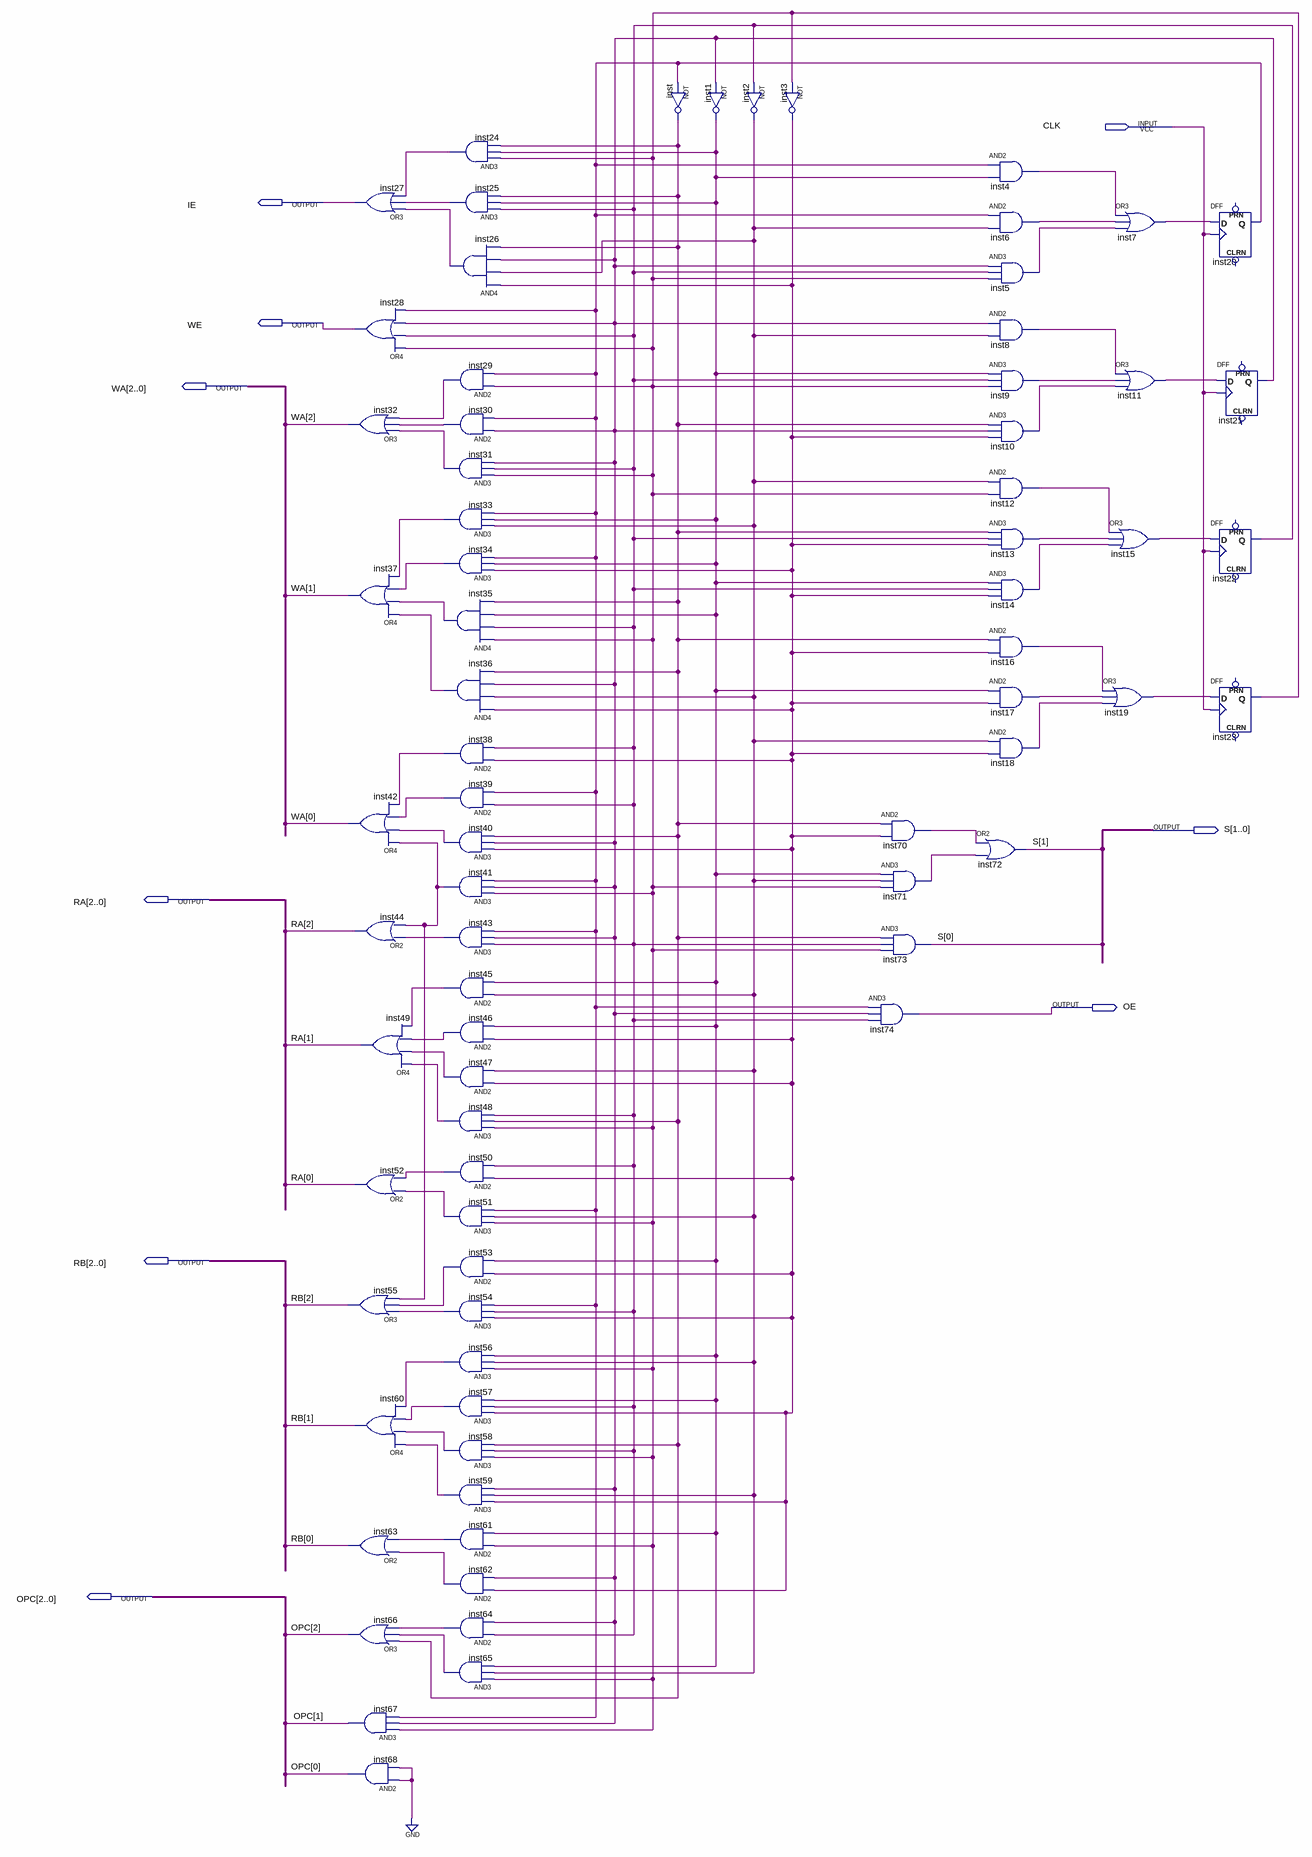
[diagram p0: schematic sheet]
// Quartus schematic Control_word.bdf as structural Verilog: 74 symbols, 9 pins
module Control_word (
  input  CLK,
  output IE,
  output WE,
  output [2:0] WA,
  output [1:0] S,
  output [2:0] RA,
  output OE,
  output [2:0] RB,
  output [2:0] OPC
);

  wire inst1_out, inst2_out, inst3_out, inst4_out, inst5_out, inst6_out, inst7_out, inst8_out, inst9_out,
       inst10_out, inst11_out, inst12_out, inst13_out, inst14_out, inst15_out, inst16_out, inst17_out,
       inst18_out, inst19_out, inst20_q, inst21_q, inst22_q, inst23_q, inst24_out, inst25_out, inst26_out,
       inst29_out, inst30_out, inst31_out, inst33_out, inst34_out, inst35_out, inst36_out, inst38_out,
       inst39_out, inst40_out, inst41_out, inst43_out, inst45_out, inst46_out, inst47_out, inst48_out,
       inst50_out, inst51_out, inst53_out, inst54_out, inst56_out, inst57_out, inst58_out, inst59_out,
       inst61_out, inst62_out, inst64_out, inst65_out, inst70_out, inst71_out, inst_out;

  or inst27 (IE, inst26_out, inst25_out, inst24_out);
  or inst28 (WE, inst23_q, inst22_q, inst21_q, inst20_q);
  or inst32 (WA[2], inst31_out, inst30_out, inst29_out);
  or inst37 (WA[1], inst36_out, inst35_out, inst34_out, inst33_out);
  or inst42 (WA[0], inst41_out, inst40_out, inst39_out, inst38_out);
  or inst44 (RA[2], inst43_out, inst41_out);
  or inst52 (RA[0], inst51_out, inst50_out);
  or inst55 (RB[2], inst54_out, inst53_out, inst41_out);
  or inst60 (RB[1], inst59_out, inst58_out, inst57_out, inst56_out);
  or inst63 (RB[0], inst62_out, inst61_out);
  or inst66 (OPC[2], inst_out, inst65_out, inst64_out);
  and inst67 (OPC[1], inst23_q, inst21_q, inst20_q);
  and inst68 (OPC[0], 1'b0, 1'b0);
  or inst49 (RA[1], inst48_out, inst47_out, inst46_out, inst45_out);
  and inst24 (inst24_out, inst23_q, inst1_out, inst_out);
  and inst25 (inst25_out, inst22_q, inst1_out, inst_out);
  and inst26 (inst26_out, inst3_out, inst2_out, inst21_q, inst_out);
  and inst29 (inst29_out, inst23_q, inst20_q);
  and inst30 (inst30_out, inst21_q, inst20_q);
  and inst31 (inst31_out, inst23_q, inst22_q, inst21_q);
  and inst33 (inst33_out, inst2_out, inst1_out, inst20_q);
  and inst34 (inst34_out, inst3_out, inst1_out, inst20_q);
  and inst35 (inst35_out, inst23_q, inst22_q, inst1_out, inst_out);
  and inst36 (inst36_out, inst3_out, inst2_out, inst21_q, inst_out);
  and inst38 (inst38_out, inst3_out, inst22_q);
  and inst39 (inst39_out, inst22_q, inst20_q);
  and inst40 (inst40_out, inst3_out, inst21_q, inst_out);
  and inst41 (inst41_out, inst23_q, inst21_q, inst20_q);
  and inst43 (inst43_out, inst22_q, inst21_q, inst20_q);
  and inst45 (inst45_out, inst2_out, inst1_out);
  and inst46 (inst46_out, inst3_out, inst1_out);
  and inst47 (inst47_out, inst3_out, inst2_out);
  and inst48 (inst48_out, inst23_q, inst_out, inst22_q);
  and inst50 (inst50_out, inst3_out, inst22_q);
  and inst51 (inst51_out, inst23_q, inst2_out, inst20_q);
  and inst53 (inst53_out, inst3_out, inst1_out);
  and inst54 (inst54_out, inst3_out, inst22_q, inst20_q);
  and inst56 (inst56_out, inst23_q, inst2_out, inst1_out);
  and inst57 (inst57_out, inst3_out, inst22_q, inst1_out);
  and inst58 (inst58_out, inst23_q, inst22_q, inst_out);
  and inst59 (inst59_out, inst3_out, inst2_out, inst21_q);
  and inst61 (inst61_out, inst23_q, inst1_out);
  and inst62 (inst62_out, inst3_out, inst21_q);
  and inst64 (inst64_out, inst22_q, inst21_q);
  and inst65 (inst65_out, inst23_q, inst2_out, inst1_out);
  not inst (inst_out, inst20_q);
  not inst1 (inst1_out, inst21_q);
  not inst2 (inst2_out, inst22_q);
  not inst3 (inst3_out, inst23_q);
  and inst70 (inst70_out, inst_out, inst3_out);
  and inst71 (inst71_out, inst1_out, inst2_out, inst23_q);
  and inst73 (S[0], inst_out, inst22_q, inst23_q);
  and inst74 (OE, inst20_q, inst21_q, inst22_q);
  and inst4 (inst4_out, inst20_q, inst1_out);
  and inst6 (inst6_out, inst20_q, inst2_out);
  and inst5 (inst5_out, inst21_q, inst22_q, inst23_q);
  and inst8 (inst8_out, inst21_q, inst2_out);
  and inst9 (inst9_out, inst1_out, inst22_q, inst23_q);
  and inst10 (inst10_out, inst_out, inst21_q, inst3_out);
  and inst12 (inst12_out, inst2_out, inst23_q);
  and inst13 (inst13_out, inst_out, inst22_q, inst3_out);
  and inst14 (inst14_out, inst1_out, inst22_q, inst3_out);
  and inst16 (inst16_out, inst_out, inst3_out);
  and inst17 (inst17_out, inst1_out, inst3_out);
  and inst18 (inst18_out, inst2_out, inst3_out);
  or inst72 (S[1], inst70_out, inst71_out);
  or inst7 (inst7_out, inst4_out, inst6_out, inst5_out);
  or inst11 (inst11_out, inst8_out, inst9_out, inst10_out);
  or inst15 (inst15_out, inst12_out, inst13_out, inst14_out);
  or inst19 (inst19_out, inst16_out, inst17_out, inst18_out);
  DFF inst20 (.CLK(CLK), .D(inst7_out), .Q(inst20_q));  // open: CLRN, PRN
  DFF inst21 (.CLK(CLK), .D(inst11_out), .Q(inst21_q));  // open: CLRN, PRN
  DFF inst22 (.CLK(CLK), .D(inst15_out), .Q(inst22_q));  // open: CLRN, PRN
  DFF inst23 (.CLK(CLK), .D(inst19_out), .Q(inst23_q));  // open: CLRN, PRN
endmodule
